# EAGLE design AmbaSat-04-OPT3001 (EAGLE 9.3.2)
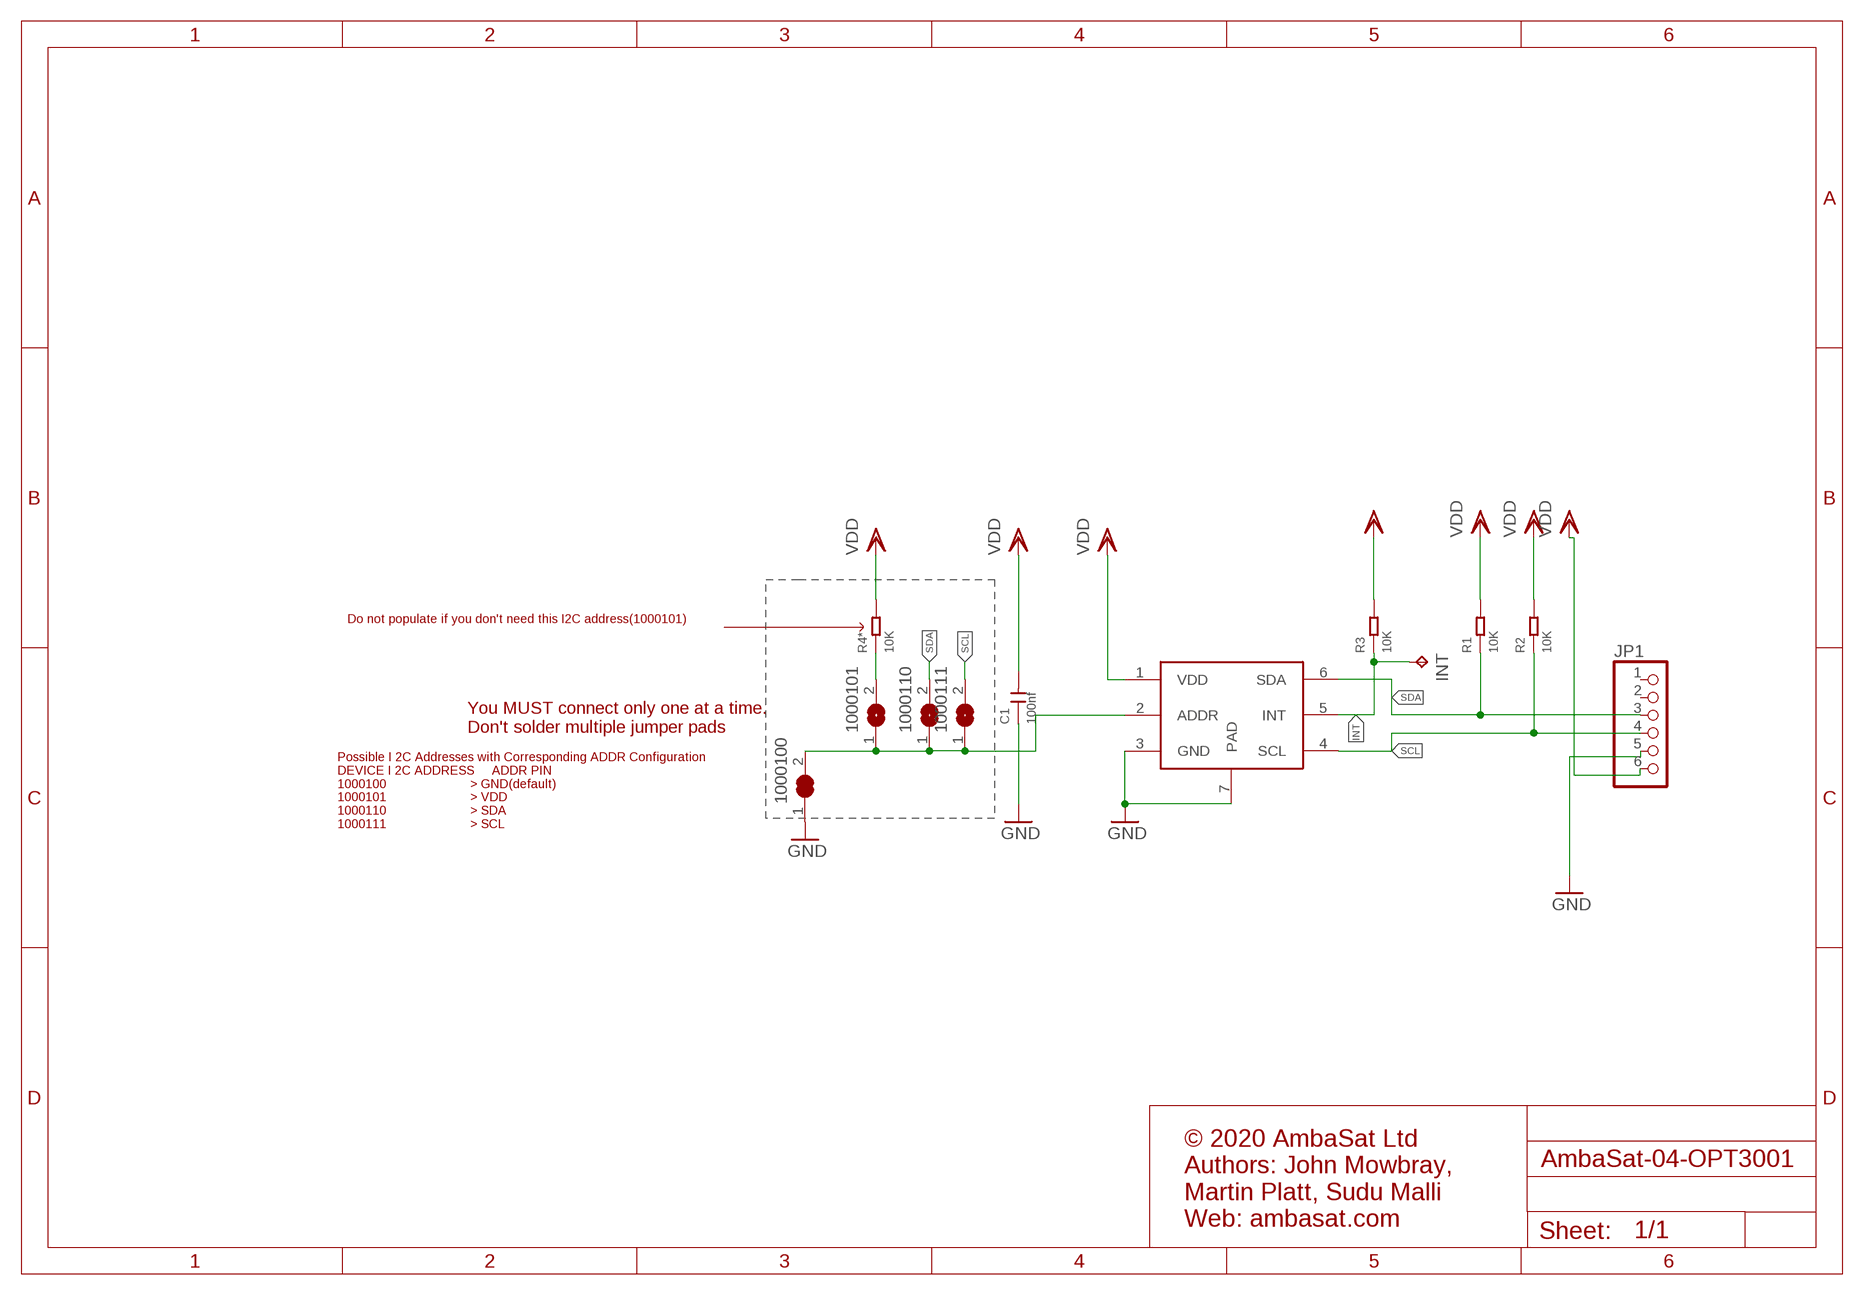
[diagram p0: schematic, sheet 1]

## Parts
1000100  SOLDERJUMPER_CLOSED  [SOLDERJUMPER_CLOSEDWIRE]
1000101  SJ  [SJ]
1000110  SJ  [SJ]
1000111  SJ  [SJ]
C1  100nf  CERAMIC-100NF-50V-10%-X7R(0805)  [C0805]
INT  TPTP11R  [TP11R]
JP1  HEADER-1X6  [1X06_OVAL]
R1  10K  SMD-RES-10K-1%-1/8W(0805)  [R0805]
R2  10K  SMD-RES-10K-1%-1/8W(0805)  [R0805]
R3  10K  SMD-RES-10K-1%-1/8W(0805)  [R0805]
R4*  10K  SMD-RES-10K-1%-1/8W(0805)  [R0805]
U2  OPT3001  [SON65P200X200X65-7N]

## Nets
GND: 1000100.1 C1.1 JP1.5 U2.3(GND) U2.7(PAD)
INT: INT.TP R3.1 U2.5(INT)
N$1: 1000101.2 R4*.1
N$3: 1000100.2 1000101.1 1000110.1 1000111.1 U2.2(ADDR)
SCL: 1000111.2 JP1.4 R2.1 U2.4(SCL)
SDA: 1000110.2 JP1.3 R1.1 U2.6(SDA)
VDD: C1.2 JP1.6 R1.2 R2.2 R3.2 R4*.2 U2.1(VDD)
Unconnected: JP1.1 JP1.2

## Notes on the sheet
- Do not populate if you don't need this I2C address(1000101)
- You MUST connect only one at a time.
  Don't solder multiple jumper pads
- Possible I 2C Addresses with Corresponding ADDR Configuration
  DEVICE I 2C ADDRESS     ADDR PIN
  1000100                        > GND(default)
  1000101                        > VDD
  1000110                        > SDA
  1000111                        > SCL
- © 2020 AmbaSat Ltd
  Authors: John Mowbray, 
  Martin Platt, Sudu Malli
  Web: ambasat.com

## Library data of the parts
1000100 = microbuilder:SOLDERJUMPER_CLOSED: Solder Jumper - Closed These solder jumpers are closed by default CLOSEDWIRE - 10 mil trace between pads that can be cut and resoldered later CLOSEDPERM - 63 mil trace between pads for a permanent connection (used to 'bridge' two signals, a shameless hack for Eagle). Can double as a test point as well (no cream layer)
1000101 1000110 1000111 = jumper:SJ: SMD solder JUMPER
C1 = Seeed-Capacitor:CERAMIC-100NF-50V-10%-X7R(0805): 302010165; MPN: CC0805KRX7R9BB104
INT = testpad:TP: Test pad
JP1 = microbuilder:HEADER-1X6: PIN HEADER
R1-R3 R4* = Seeed-Resistor:SMD-RES-10K-1%-1/8W(0805): 301010361; MPN: RC0805FR-0710KL
U2 = OPT3001:OPT3001: The OPT3001 is a sensor that measures the intensity of visible light. The spectral response of the sensor tightly matches the photopic response of the human eye and includes significant infrared rejection. The OPT3001 is a single-chip lux meter, measuring the intensity of light as visible by the human eye. The precision spectral response and strong IR rejection of the device enables the OPT3001 to accurately meter the intensity of light as seen by the human eye regardless of light source. The strong IR rejection also aids in maintaining high accuracy when industrial design calls for mounting the sensor under dark glass for aesthetics. The OPT3001 is designed for systems that create light-based experiences for humans, and an ideal preferred replacement for photodiodes, photoresistors, or other ambient light sensors with less human eye matching and IR rejection. Measurements can be made from 0.01 lux up to 83k lux without manually selecting full-scale ranges by using the built-in, full-scale setting feature. This capability allows light measurement over a 23-bit effective dynamic range. The digital operation is flexible for system integration. Measurements can be either continuous or singleshot. The control and interrupt system features autonomous operation, allowing the processor to sleep while the sensor searches for appropriate wake-up events to report via the interrupt pin. The digital output is reported over an I 2C- and SMBuscompatible, two-wire serial interface. The low power consumption and low power-supply voltage capability of the OPT3001 enhance the battery life of battery-powered systems.; M: Texas Instrument; MPN: OPT3001DNPT

## Board
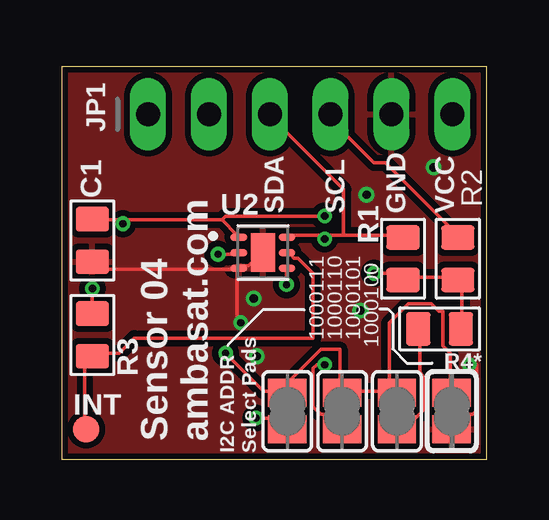
[diagram p1: board, top side]
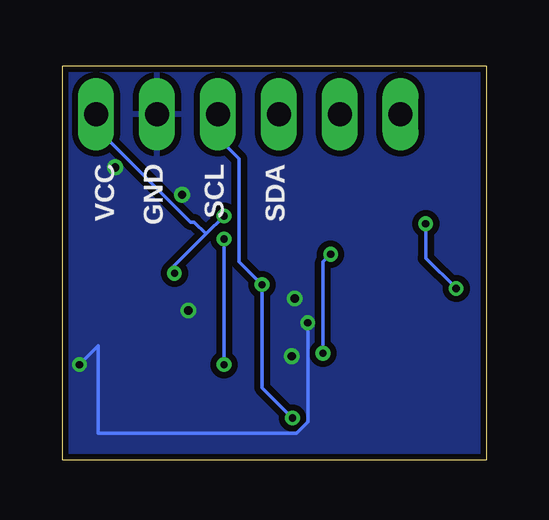
[diagram p2: board, bottom side, seen from below]

Size 17.7 x 16.4 mm. Coordinates in mm from the lower left corner, seen from the top.
Outline: 0,16.4 17.7,16.4 17.7,0 0,0 0,16.4
Copper layers (1*16): Top 0.035mm / dielectric 1.5mm / Bottom 0.035mm
Design rules "SeeedStudio_2layer_DRU_no_angle_20140221": minimum track width 6mil, minimum drill 12mil, track to track 6mil, track to pad 6mil, pad to pad 6mil, via to via 6mil, smd to smd 0mil, copper to edge 10mil, drill to drill 10mil, minimum pad ring 10mil, minimum via ring 6mil, stop-mask expansion 2mil, vias tented up to drill 100mil, thermal gap 10mil

### Footprints (pad centres in the part's own frame; a part is rotated, then mirrored left to right if it is on the bottom)
SOLDERJUMPER_CLOSEDWIRE = smd 1.168 x 1.6: 1 -0.762,0; 2 0.762,0 | smd 0.635 x 0.203: WIRE 0,0
SJ = smd 1.168 x 1.6: 1 -0.762,0; 2 0.762,0
C0805 = smd 1.397 x 1.016: 1 0,0.889; 2 0,-0.889
TP11R = smd 1.1 x 1.1: TP 0,0
1X06_OVAL = drill 1 long: 1 -6.35,0; 2 -3.81,0; 3 -1.27,0; 4 1.27,0; 5 3.81,0; 6 6.35,0
R0805 = smd 1.397 x 1.016: 1 0,0.889; 2 0,-0.889
SON65P200X200X65-7N = smd 0.71 x 0.32: 1 -1.005,0.65; 2 -1.005,0; 3 -1.005,-0.65; 4 1.005,-0.65; 5 1.005,0; 6 1.005,0.65 | smd 1 x 1.6: 7 0,0

### Placement (x,y rotation side)
1000100  16.26,2.03 90 top
1000101  13.97,2.03 270 top
1000110  11.68,2.03 270 top
1000111  9.4,2.03 270 top
C1  1.27,9.14 180 top
INT  1.02,1.27 0 top
JP1  9.94,14.4 0 top
R1  14.22,8.38 0 top
R2  16.51,8.38 0 top
R3  1.27,5.21 180 top
R4*  15.75,5.46 90 top
U2  8.38,8.64 0 top

### Tracks (layer width: path | path; a pad name or v marks a point on that pad's centre or on a via)
GND  (via drill 0.3, 0.35)
  Top 0.152: U2.7 8.26,8.57 7.78,8.1 7.46,8.1 U2.3 7.3,7.94 | C1.1 1.59,7.94 7.3,7.94 | v16.99,3.97 17.3,3.97 17.3,2.06 17.14,1.91 16.99,1.91 16.35,1.27 1000100.1 | 7.3,7.94 7.3,5.71 v7.46,5.71
  Bottom 0.152: v16.99,3.97 16.19,4.76 16.19,1.11 7.94,1.11 7.46,1.59 v7.46,5.71
  other vias: 12.7,11.05 15.49,12.19 12.45,6.22 8.13,4.32 8,6.73
  pour Top (isolate 0.254): 0,16.4 0,0 17.7,0 17.7,16.4
  pour Bottom (isolate 0.254): 0,16.4 0,0 17.7,0 17.7,16.4
INT
  Top 0.152: U2.5 9.53,8.57 9.68,8.41 9.84,8.41 10.48,7.78 10.48,5.08 3.02,5.08 2.38,4.45 1.27,4.45 R3.1 1.27,4.29 0.95,4.29 0.95,1.27 INT.TP
N$1
  Top 0.152: 1000101.2 14.29,1.27 15.08,2.06 15.08,3.49 14.92,3.65 14.92,5.4 R4*.1
N$3  (via drill 0.3)
  Top 0.152: 13.65,2.86 13.97,2.86 1000101.1 13.65,2.86 | 13.65,2.86 11.75,2.86 1000110.1 11.59,2.86 11.59,4.6 10.79,4.6 9.05,2.86 | 13.65,2.86 13.65,5.71 14.45,6.51 15.4,6.51 15.72,6.19 15.88,6.19 15.88,4.76 16.19,4.45 16.19,2.86 1000100.2 | v6.51,8.57 7.3,8.57 U2.2 | v6.83,4.45 8.41,2.86 9.05,2.86 | 9.05,2.86 9.37,2.86 1000111.1 9.05,2.86
  Bottom 0.152: v6.51,8.57 6.83,8.26 v6.83,4.45
SCL  (via drill 0.3)
  Top 0.152: v9.37,7.3 9.37,7.94 U2.4 | R2.1 16.51,9.37 13.49,12.38 13.02,12.38 11.11,14.29 JP1.4 | v8.1,1.75 8.89,1.75 9.37,1.27 1000111.2
  Bottom 0.152: JP1.4 11.11,14.29 11.11,13.34 10.32,12.54 10.32,8.26 v9.37,7.3 9.37,3.02 v8.1,1.75
SDA  (via drill 0.3)
  Top 0.152: 11.75,9.37 14.13,9.37 R1.1 | 11.75,9.37 10.95,9.37 | 10.95,9.37 9.53,9.37 U2.6 | v10.95,3.97 10.64,3.97 10.48,3.81 10.48,2.22 10.79,1.91 10.95,1.91 11.59,1.27 1000110.2 | 10.95,9.37 v10.95,9.21 | 11.75,9.37 11.75,11.27 8.73,14.29 JP1.3
  Bottom 0.152: v10.95,9.21 v10.95,3.97
VDD  (via drill 0.3)
  Top 0.152: 6.67,10 7.3,9.37 U2.1 | 2.54,10 1.27,10 C1.2 | 2.54,10 6.67,10 | v1.27,7.14 R3.2 | 2.54,10 v2.54,9.84 | R4*.2 16.67,5.56 16.67,7.46 16.51,7.46 R2.2 16.51,7.62 14.29,7.62 R1.2 14.13,7.62 13.97,7.78 v13.02,7.78 | 6.67,10 6.83,10.16 v10.95,10.16
  Bottom 0.152: v1.27,7.14 2.54,8.41 v2.54,9.84 | 11.7,9.41 13.18,7.94 v13.02,7.78 | 11.7,9.41 v10.95,10.16 | 11.7,9.41 12.19,9.91 12.34,9.91 16.15,13.72 16.15,14.33 JP1.6

### Text on the board
tPlace: SDA | SCL | GND | VCC | Sensor 04 / ambasat.com | I2C ADDR / Select Pads
bPlace: SDA | SCL | GND | VCC